# EasyEDA Pro project Baby8-seqV3.eprj

# Board PCB1
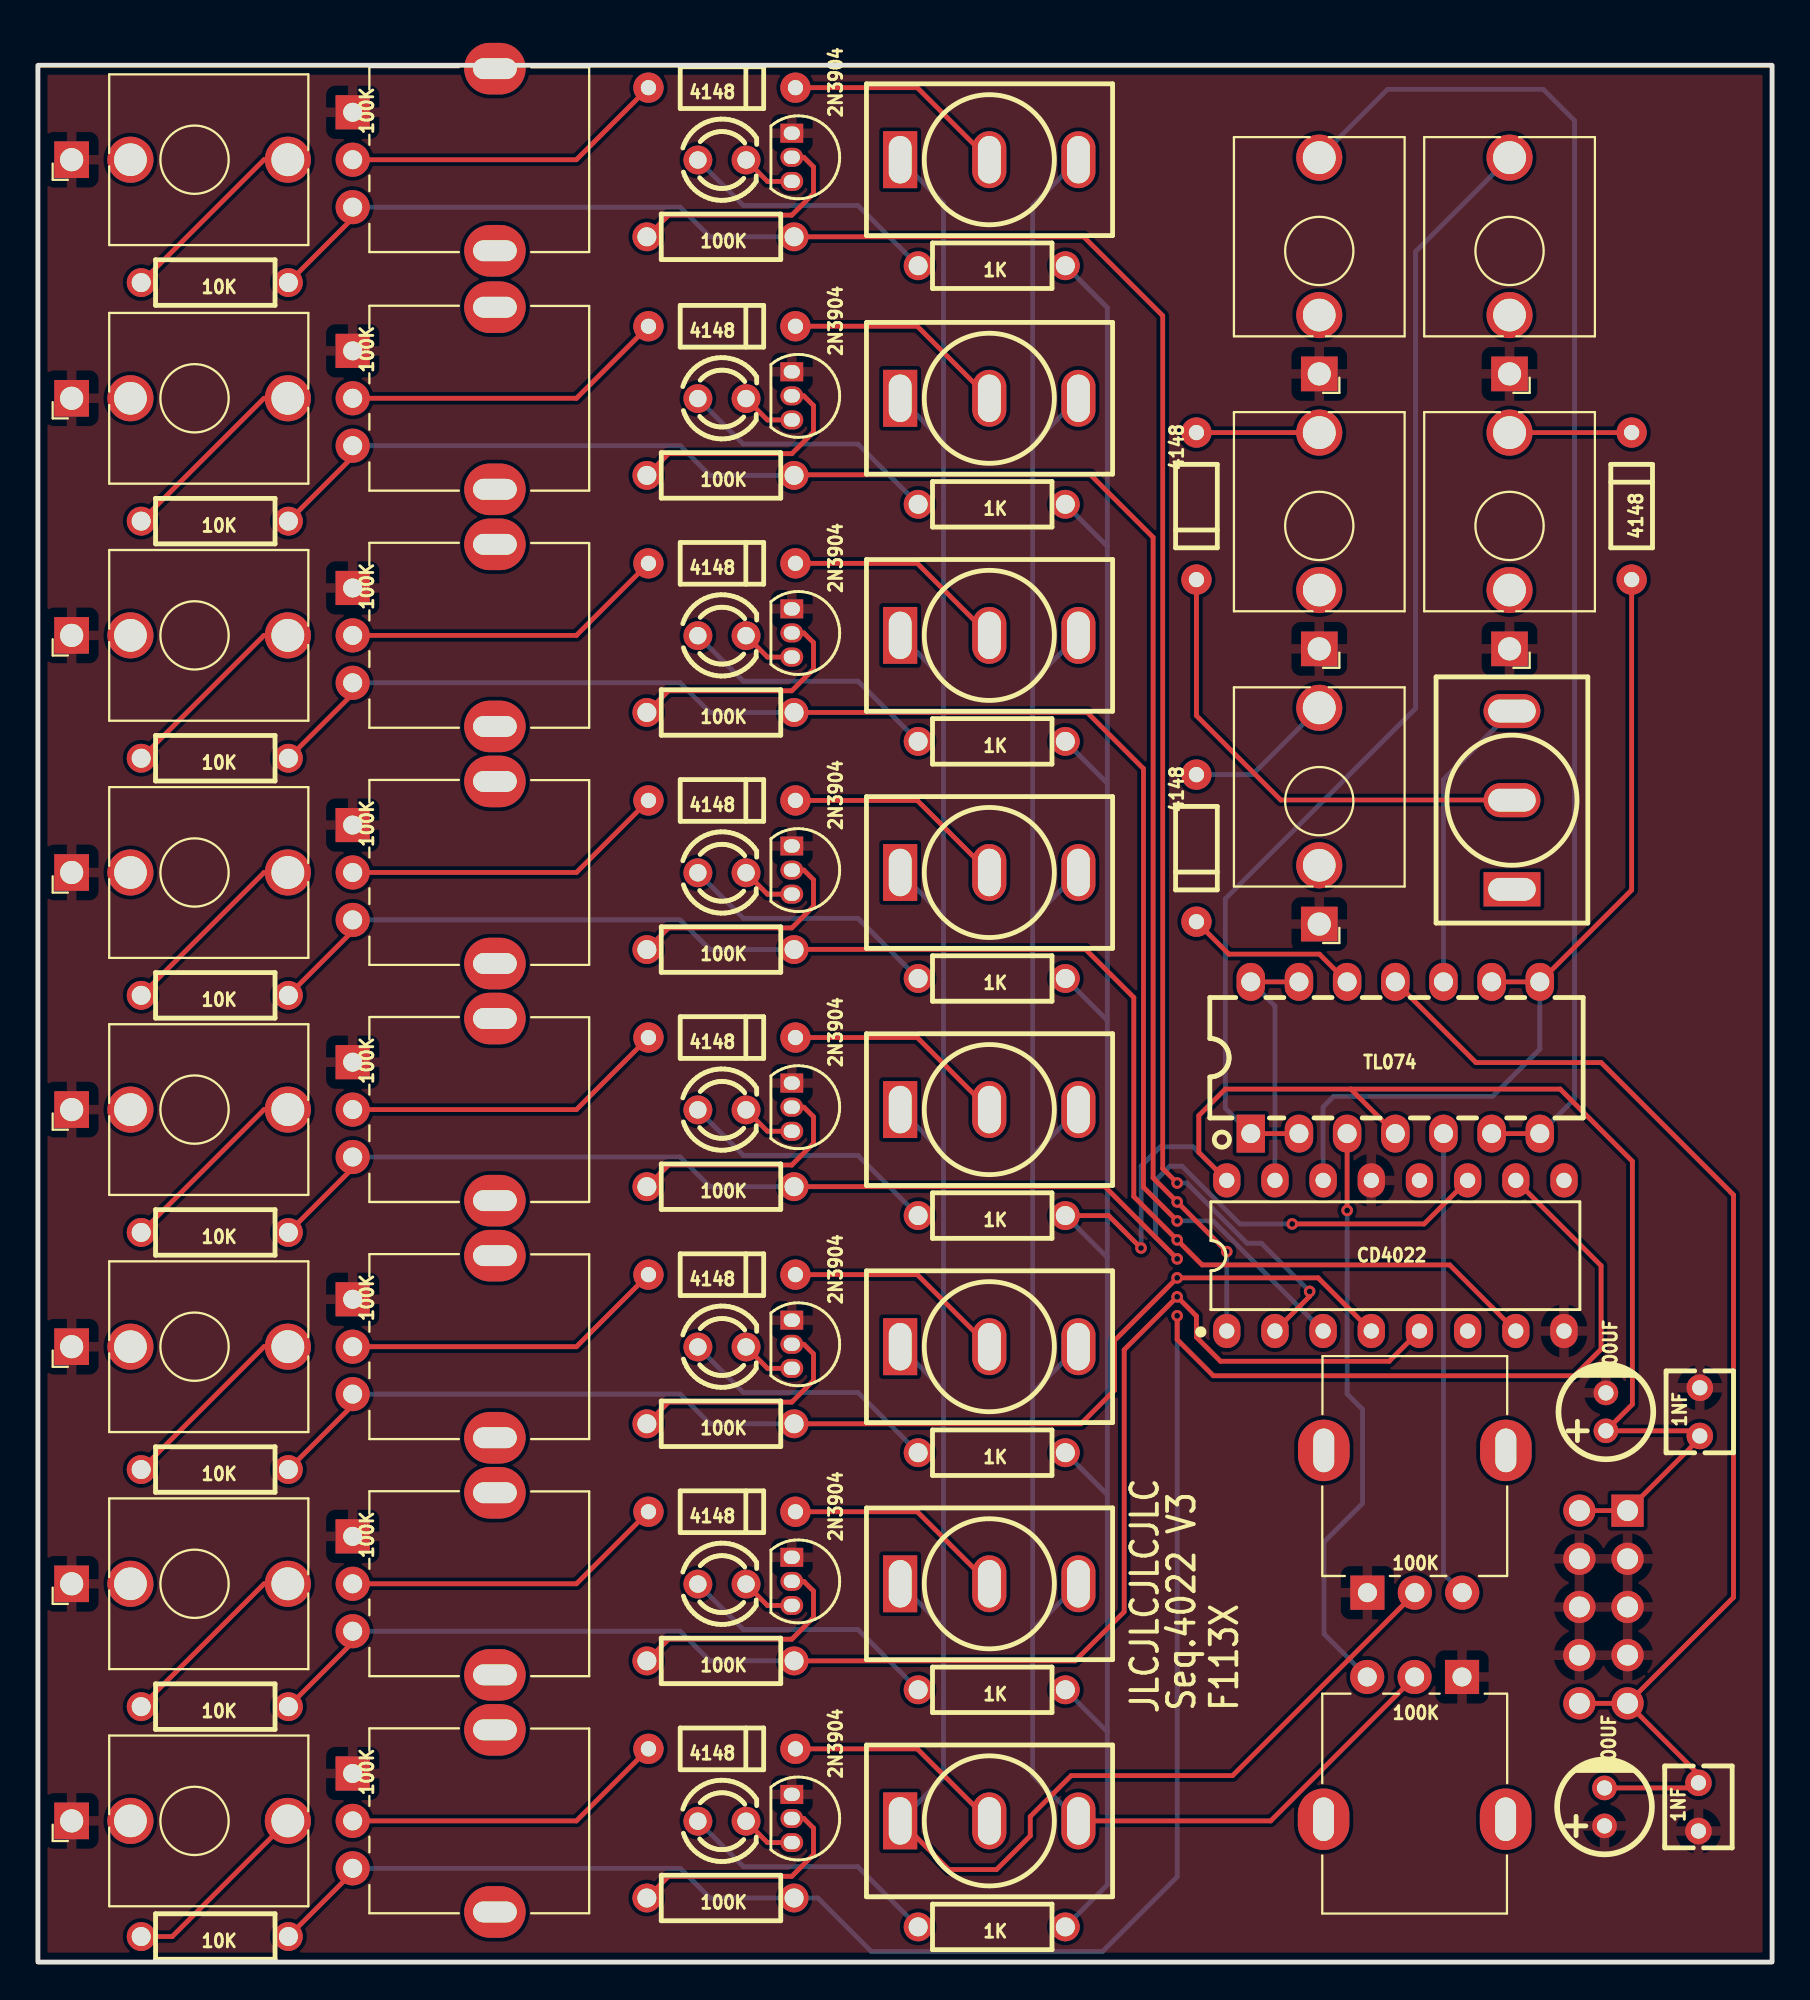
[diagram p0: board, top side]
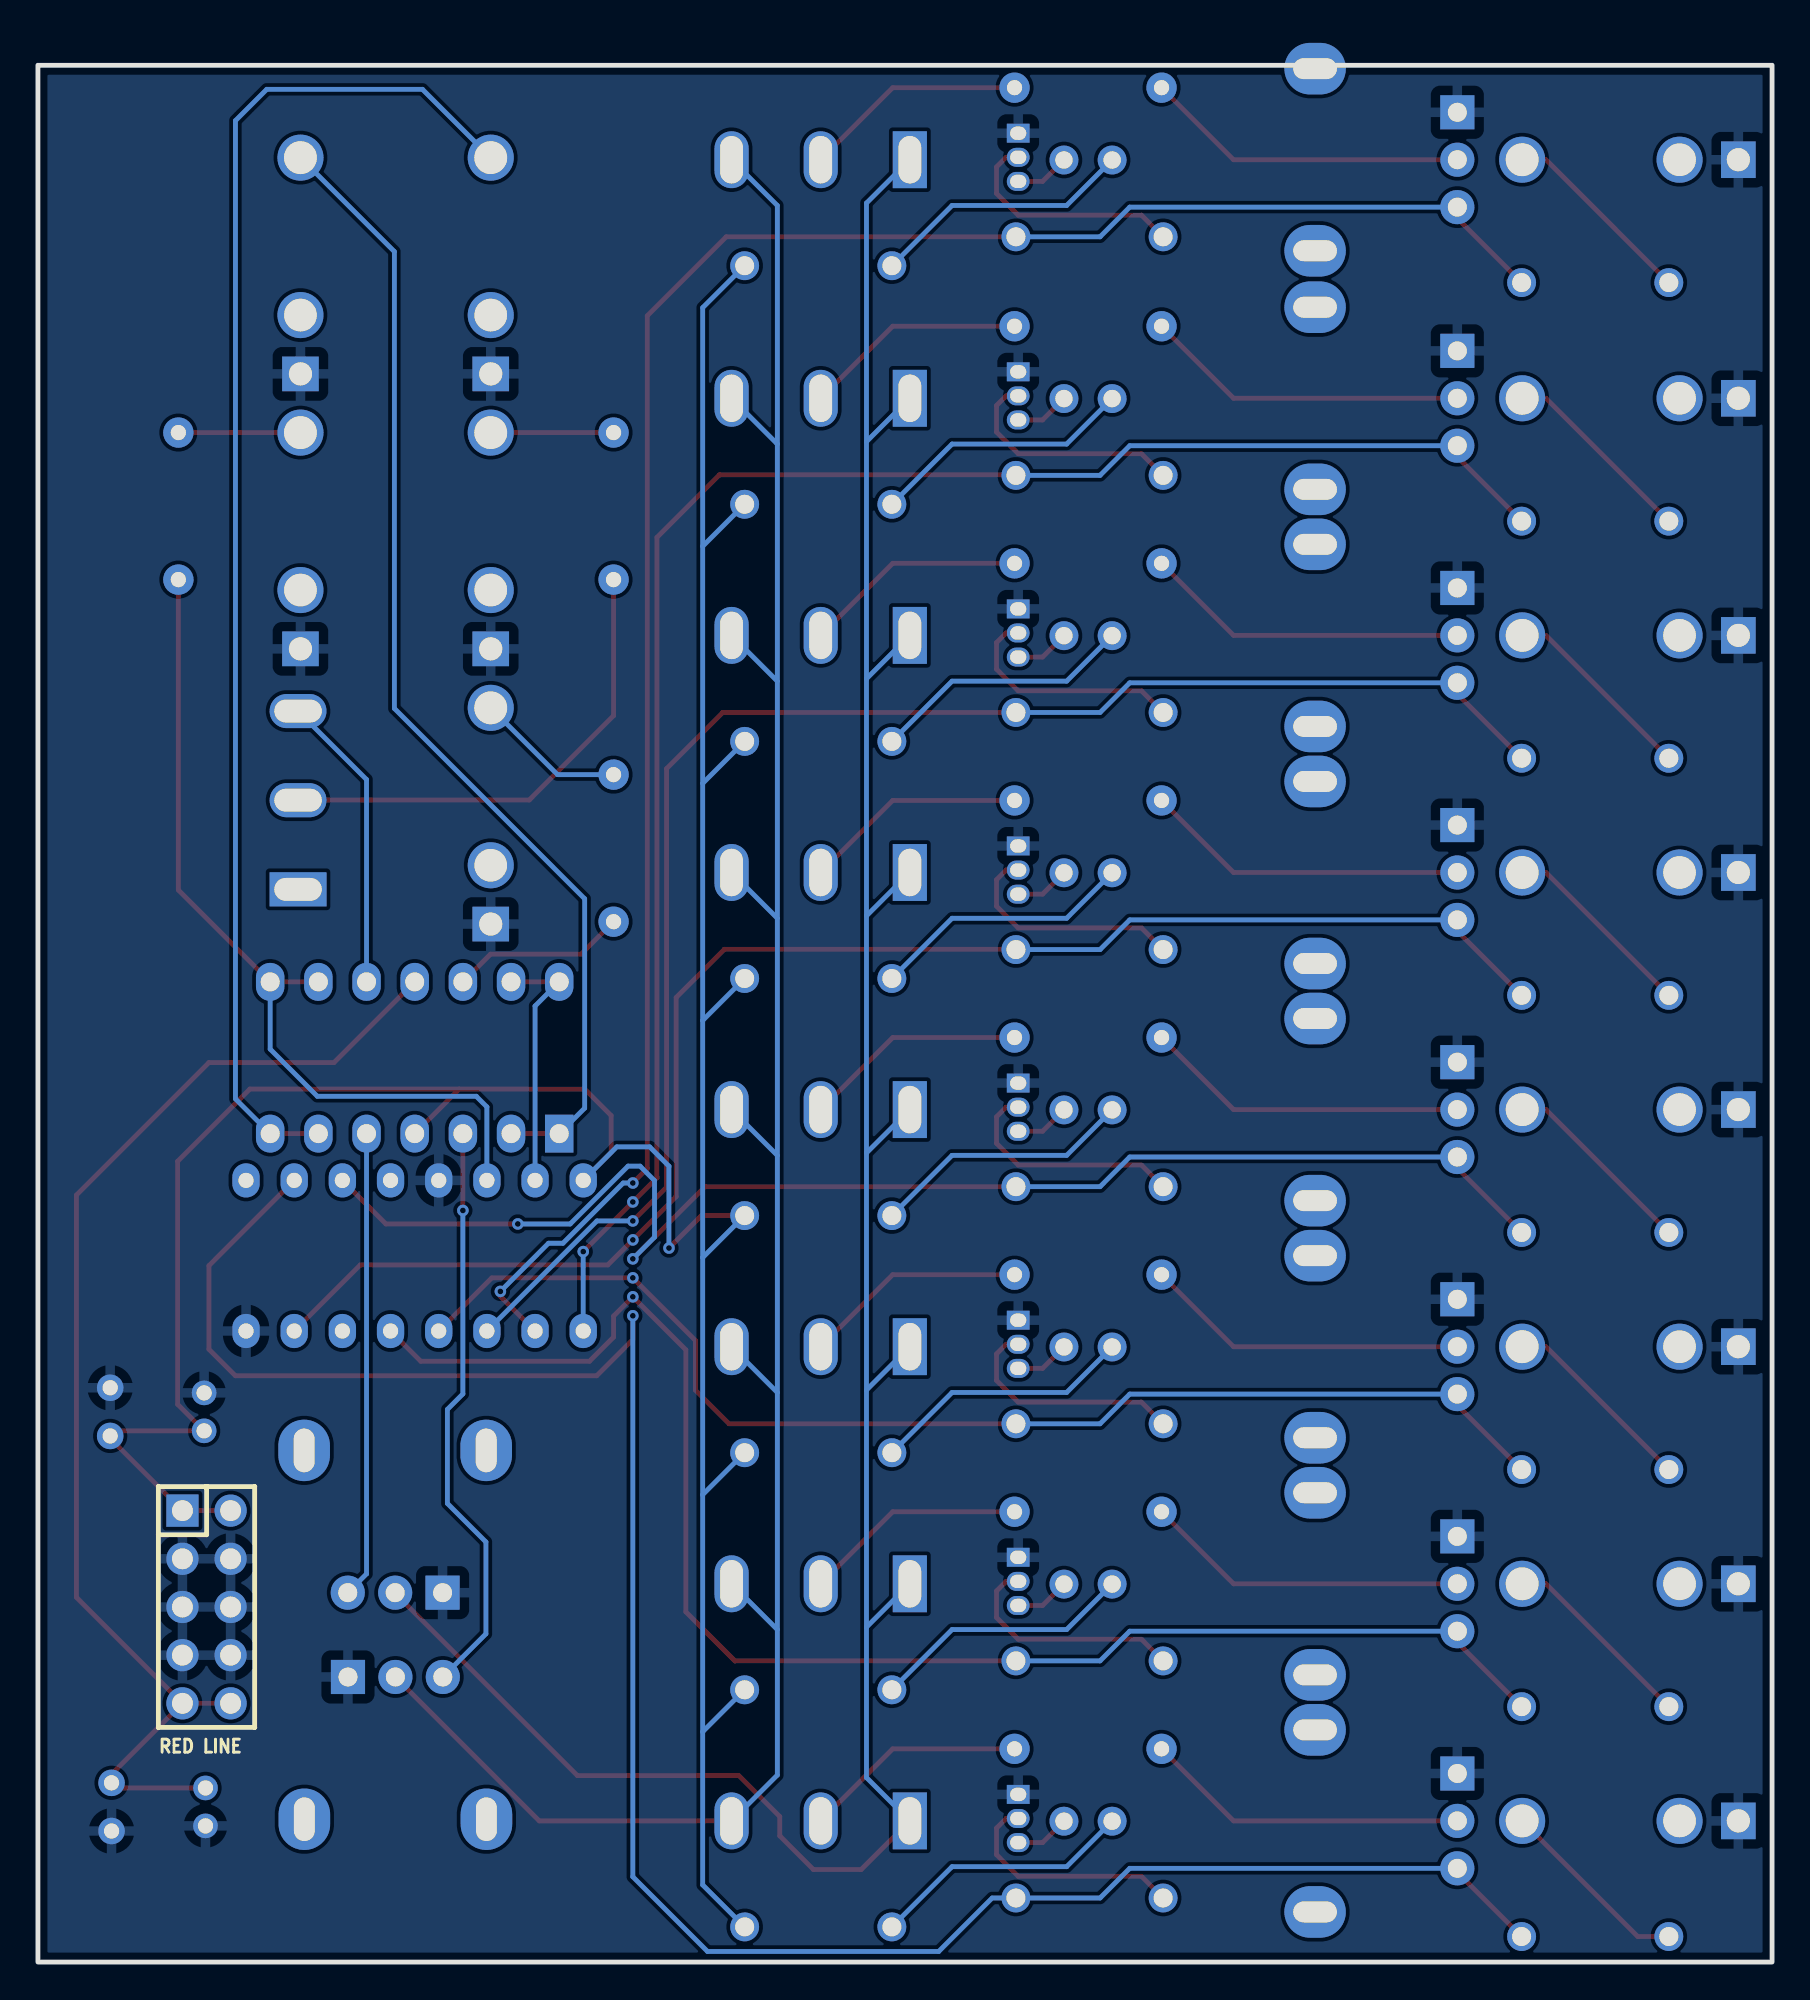
[diagram p1: board, bottom side, seen from below]

Outline 91.44 x 100 mm; copper layers: Top Layer, Bottom Layer. Coordinates in mm from the lower left corner of the outline.
Outline path: rectangle 0,100 91.44,0
Stack: Top Layer 0.035mm / Dielectric1 1.51mm FR4 er 4.5 / Bottom Layer 0.035mm

## Design rules (mm)
template: JLCPCB Capability(Two Layers Board)
spacing copperThickness1oz (default): track to track 0.102, other pairs 0.152 to 0.3
spacing copperThickness2oz: track to track 0.203, other pairs 0.152 to 0.3
track width copperThickness1oz (default): min 0.127, default 0.254, max 2.54
track width copperThickness2oz: min 0.203, default 0.254, max 2.54
differential pair differentialPair (default): width min 0.127, default 0.254, max 2.54; gap min 0.152, default 0.152
via viaSize (default): diameter min 0.5, default 0.61, max 10; hole min 0.3, default 0.305, max 6.3

## Placement (name value [footprint] x y rotation side)
1K  -  [Resistor_Small]  50.29 26.85 0 top
1K#2  -  [Resistor_Small]  50.29 89.43 0 top
1K#3  -  [Resistor_Small]  50.29 76.85 0 top
1K#4  -  [Resistor_Small]  50.29 64.35 0 top
1K#5  -  [Resistor_Small]  50.29 51.85 0 top
1K#6  -  [Resistor_Small]  50.29 39.35 0 top
1K#7  -  [Resistor_Small]  50.29 14.35 0 top
1K#8  -  [Resistor_Small]  50.29 1.85 0 top
1NF  -  [CAP-TH_L4.2-W3.5-P2.54-D0.5]  87.56 8.18 90 top
1NF#2  -  [CAP-TH_L4.2-W3.5-P2.54-D0.5]  87.63 29.01 90 top
2N3904  -  [TO-92-3_L4.5-W3.5-P1.27-L]  39.75 95.15 270 top
2N3904#2  -  [TO-92-3_L4.5-W3.5-P1.27-L]  39.75 82.57 270 top
2N3904#3  -  [TO-92-3_L4.5-W3.5-P1.27-L]  39.75 70.07 270 top
2N3904#4  -  [TO-92-3_L4.5-W3.5-P1.27-L]  39.75 57.57 270 top
2N3904#5  -  [TO-92-3_L4.5-W3.5-P1.27-L]  39.75 45.07 270 top
2N3904#6  -  [TO-92-3_L4.5-W3.5-P1.27-L]  39.75 32.57 270 top
2N3904#7  -  [TO-92-3_L4.5-W3.5-P1.27-L]  39.75 20.07 270 top
2N3904#8  -  [TO-92-3_L4.5-W3.5-P1.27-L]  39.75 7.57 270 top
10K  -  [Resistor_Small]  9.32 88.54 0 top
10K#2  -  [Resistor_Small]  9.32 75.97 0 top
10K#3  -  [Resistor_Small]  9.32 63.47 0 top
10K#4  -  [Resistor_Small]  9.32 50.97 0 top
10K#5  -  [Resistor_Small]  9.32 38.47 0 top
10K#6  -  [Resistor_Small]  9.32 25.97 0 top
10K#7  -  [Resistor_Small]  9.32 13.47 0 top
10K#8  -  [Resistor_Small]  9.32 1.35 0 top
100K  -  [Resistor_Small]  35.99 90.96 0 top
100K#2  -  [Resistor_Small]  35.99 78.38 0 top
100K#3  -  [Resistor_Small]  35.99 65.88 0 top
100K#4  -  [Resistor_Small]  35.99 53.38 0 top
100K#5  -  [Resistor_Small]  35.99 40.88 0 top
100K#6  -  [Resistor_Small]  35.99 28.38 0 top
100K#7  -  [Resistor_Small]  35.99 15.88 0 top
100K#8  -  [Resistor_Small]  35.99 3.38 0 top
100K#9  -  [benjiaomodular:Potentiometer_RV09]  16.6 97.52 0 top
100K#10  -  [benjiaomodular:Potentiometer_RV09]  16.6 84.94 0 top
100K#11  -  [benjiaomodular:Potentiometer_RV09]  16.6 72.44 0 top
100K#12  -  [benjiaomodular:Potentiometer_RV09]  16.6 59.94 0 top
100K#13  -  [benjiaomodular:Potentiometer_RV09]  16.6 47.44 0 top
100K#14  -  [benjiaomodular:Potentiometer_RV09]  16.6 34.94 0 top
100K#15  -  [benjiaomodular:Potentiometer_RV09]  16.6 22.44 0 top
100K#16  -  [benjiaomodular:Potentiometer_RV09]  16.6 9.94 0 top
100K#17  -  [benjiaomodular:Potentiometer_RV09]  70.1 19.47 90 top
100K#18  -  [benjiaomodular:Potentiometer_RV09]  75.09 15.03 270 top
100UF  -  [CAP-TH_BD5.0-P2.00-D0.8-FD]  82.6 8.18 90 top
100UF#2  -  [CAP-TH_BD5.0-P2.00-D0.8-FD]  82.68 29.01 90 top
4148  -  [DO-35_BD2.0-L4.2-P8.20-D0.5-RD]  61.09 76.76 90 top
4148#2  -  [DO-35_BD2.0-L4.2-P8.20-D0.5-RD]  84.04 76.76 270 top
4148#3  -  [DO-35_BD2.0-L4.2-P8.20-D0.5-RD]  36.07 98.82 180 top
4148#4  -  [DO-35_BD2.0-L4.2-P8.20-D0.5-RD]  61.09 58.72 90 top
4148#5  -  [DO-35_BD2.0-L4.2-P8.20-D0.5-RD]  36.07 86.24 180 top
4148#6  -  [DO-35_BD2.0-L4.2-P8.20-D0.5-RD]  36.07 73.74 180 top
4148#7  -  [DO-35_BD2.0-L4.2-P8.20-D0.5-RD]  36.07 61.24 180 top
4148#8  -  [DO-35_BD2.0-L4.2-P8.20-D0.5-RD]  36.07 48.74 180 top
4148#9  -  [DO-35_BD2.0-L4.2-P8.20-D0.5-RD]  36.07 36.24 180 top
4148#10  -  [DO-35_BD2.0-L4.2-P8.20-D0.5-RD]  36.07 23.74 180 top
4148#11  -  [DO-35_BD2.0-L4.2-P8.20-D0.5-RD]  36.07 11.24 180 top
CD4022  CD4017CN  [PDIP-16_L19.3-W6.4-P2.54-LS7.94-BL]  71.58 37.24 0 top
J1  -  [benjiaomodular:AudioJack_3.5mm]  1.78 95.02 90 top
J1#2  -  [benjiaomodular:AudioJack_3.5mm]  1.78 82.44 90 top
J1#3  -  [benjiaomodular:AudioJack_3.5mm]  1.78 69.94 90 top
J1#4  -  [benjiaomodular:AudioJack_3.5mm]  1.78 57.44 90 top
J1#5  -  [benjiaomodular:AudioJack_3.5mm]  1.78 44.94 90 top
J1#6  -  [benjiaomodular:AudioJack_3.5mm]  1.78 32.44 90 top
J1#7  -  [benjiaomodular:AudioJack_3.5mm]  1.78 19.94 90 top
J1#8  -  [benjiaomodular:AudioJack_3.5mm]  1.78 7.44 90 top
J1#9  -  [benjiaomodular:AudioJack_3.5mm]  67.56 69.23 180 top
J1#10  -  [benjiaomodular:AudioJack_3.5mm]  77.6 69.23 180 top
J1#11  -  [benjiaomodular:AudioJack_3.5mm]  77.6 83.73 180 top
J1#12  -  [benjiaomodular:AudioJack_3.5mm]  67.56 83.73 180 top
J1#13  -  [benjiaomodular:AudioJack_3.5mm]  67.56 54.72 180 top
LED1  -  [LED-TH_BD3.0-P2.54-FD]  36.07 95 0 top
LED1#2  -  [LED-TH_BD3.0-P2.54-FD]  36.07 82.43 0 top
LED1#3  -  [LED-TH_BD3.0-P2.54-FD]  36.07 69.93 0 top
LED1#4  -  [LED-TH_BD3.0-P2.54-FD]  36.07 57.43 0 top
LED1#5  -  [LED-TH_BD3.0-P2.54-FD]  36.07 44.93 0 top
LED1#6  -  [LED-TH_BD3.0-P2.54-FD]  36.07 32.43 0 top
LED1#7  -  [LED-TH_BD3.0-P2.54-FD]  36.07 19.93 0 top
LED1#8  -  [LED-TH_BD3.0-P2.54-FD]  36.07 7.43 0 top
RED LINE  ZX-PZ2.54-2-5PZZ  [HDR-TH_10P-P2.54-V-M-R2-C5-S2.54]  82.55 18.72 270 bottom
TL074  TL074CN  [PDIP-14_L19.7-W6.6-P2.54-LS8.3-BL]  71.57 47.68 0 top
U1  -  [SW-TH_MT-0-103-A101-M200-RS]  50.16 95.02 0 top
U1#2  -  [SW-TH_MT-0-103-A101-M200-RS]  77.72 61.25 90 top
U1#3  -  [SW-TH_MT-0-103-A101-M200-RS]  50.16 82.44 0 top
U1#4  -  [SW-TH_MT-0-103-A101-M200-RS]  50.16 69.94 0 top
U1#5  -  [SW-TH_MT-0-103-A101-M200-RS]  50.16 57.44 0 top
U1#6  -  [SW-TH_MT-0-103-A101-M200-RS]  50.16 44.94 0 top
U1#7  -  [SW-TH_MT-0-103-A101-M200-RS]  50.16 32.44 0 top
U1#8  -  [SW-TH_MT-0-103-A101-M200-RS]  50.16 19.94 0 top
U1#9  -  [SW-TH_MT-0-103-A101-M200-RS]  50.16 7.44 0 top

## Footprints (pads in the part's own frame, mm; a bottom-side part is the same pattern mirrored in y, then rotated)
benjiaomodular:AudioJack_3.5mm
  rect 1.93x1.83 hole 1.22: S(0,0)
  round 2.43 hole 1.73: T(0,-11.4)
  round 2.43 hole 1.72: TN(0,-3.1)
benjiaomodular:Potentiometer_RV09
  rect 1.8x1.8 hole 1: 1(0,0)
  round 1.8 hole 1: 2(0,-2.5) 3(0,-5)
  oval 3.24x2.72 hole 2.3x1.1: 4(7.5,-7.3) 5(7.5,2.3)
CAP-TH_BD5.0-P2.00-D0.8-FD
  round 1.3 hole 0.8: 1(-1,0) 2(1,0)
CAP-TH_L4.2-W3.5-P2.54-D0.5
  round 1.4 hole 0.8: 1(-1.27,0) 2(1.27,0)
DO-35_BD2.0-L4.2-P8.20-D0.5-RD
  round 1.6 hole 0.8: 1(-3.876,0) 2(3.876,0)
HDR-TH_10P-P2.54-V-M-R2-C5-S2.54
  rect 1.7x1.7 hole 1.1: 1(-5.08,-1.27)
  round 1.7 hole 1.1: 2(-5.08,1.27) 3(-2.54,-1.27) 4(-2.54,1.27) 5(0,-1.27) 6(0,1.27) 7(2.54,-1.27) 8(2.54,1.27) 9(5.08,-1.27) 10(5.08,1.27)
LED-TH_BD3.0-P2.54-FD
  round 1.524 hole 0.914: 1(-1.27,0) 2(1.27,0)
PDIP-14_L19.7-W6.6-P2.54-LS8.3-BL
  rect 1.5x2 hole 1: 1(-7.62,-4)
  oval 1.5x2 hole 1: 2(-5.08,-4) 3(-2.54,-4) 4(0,-4) 5(2.54,-4) 6(5.08,-4) 7(7.62,-4) 8(7.62,4) 9(5.08,4) 10(2.54,4) 11(0,4) 12(-2.54,4) 13(-5.08,4) 14(-7.62,4)
PDIP-16_L19.3-W6.4-P2.54-LS7.94-BL
  oval 1.44x1.8 hole 0.8: 1(-8.89,-3.97) 2(-6.35,-3.97) 3(-3.81,-3.97) 4(-1.27,-3.97) 5(1.27,-3.97) 6(3.81,-3.97) 7(6.35,-3.97) 8(8.89,-3.97) 9(8.89,3.97) 10(6.35,3.97) 11(3.81,3.97) 12(1.27,3.97) 13(-1.27,3.97) 14(-3.81,3.97) 15(-6.35,3.97) 16(-8.89,3.97)
Resistor_Small
  round 1.524 hole 1: 1(-3.88,0) 2(3.882,0)
SW-TH_MT-0-103-A101-M200-RS
  rect 1.8x3 hole 1.2x2.5: 1(-4.7,0)
  oval 1.8x3 hole 1.2x2.5: 2(0,0) 3(4.7,0)
TO-92-3_L4.5-W3.5-P1.27-L
  rect 1x1.2 hole 0.7x0.85: 1(-1.27,0)
  oval 1x1.2 hole 0.7x0.85: 2(0,0) 3(1.27,0)

## Nets
GND: 1NF.1 1NF#2.2 2N3904.1 2N3904#2.1 2N3904#3.1 2N3904#4.1 2N3904#5.1 2N3904#6.1 2N3904#7.1 2N3904#8.1 100K#9.1 100K#10.1 100K#11.1 100K#12.1 100K#13.1 100K#14.1 100K#15.1 100K#16.1 100K#17.1 100K#18.1 100UF.1 100UF#2.2 CD4022.8 CD4022.13 J1.S J1#2.S J1#3.S J1#4.S J1#5.S J1#6.S J1#7.S J1#8.S J1#9.S J1#10.S J1#11.S J1#12.S J1#13.S RED LINE.3 RED LINE.4 RED LINE.5 RED LINE.6 RED LINE.7 RED LINE.8
+12: 1K.2 1K#2.2 1K#3.2 1K#4.2 1K#5.2 1K#6.2 1K#7.2 1K#8.2 1NF#2.1 100UF#2.1 CD4022.16 RED LINE.1 RED LINE.2 TL074.4
-12: 1NF.2 100UF.2 RED LINE.9 RED LINE.10 TL074.11
CLK: 4148#2.2 CD4022.14 TL074.8 TL074.9
CLK_IN: 4148.2 J1#9.T
CLK_OUT: 4148#2.1 J1#10.T
CV1: J1#12.T TL074.6 TL074.7
CV2: J1#11.T TL074.1 TL074.2
RST: CD4022.15 TL074.13 TL074.14
RST_IN: 4148#4.2 J1#13.T
STEP1: 10K.2 100K.2 100K#9.3 CD4022.2
STEP2: 10K#2.2 100K#2.2 100K#10.3 CD4022.1
STEP3: 10K#3.2 100K#3.2 100K#11.3 CD4022.3
STEP4: 10K#4.2 100K#4.2 100K#12.3 CD4022.7
STEP5: 10K#5.2 100K#5.2 100K#13.3 CD4022.11
STEP6: 10K#6.2 100K#6.2 100K#14.3 CD4022.4
STEP7: 10K#7.2 100K#7.2 100K#15.3 CD4022.5
STEP8: 10K#8.2 100K#8.2 100K#16.3 CD4022.10
TRACK1: 100K#17.2 U1.1 U1#3.1 U1#4.1 U1#5.1 U1#6.1 U1#7.1 U1#8.1 U1#9.1
TRACK1+: 100K#17.3 TL074.5
TRACK2: 100K#18.2 U1.3 U1#3.3 U1#4.3 U1#5.3 U1#6.3 U1#7.3 U1#8.3 U1#9.3
TRACK2+: 100K#18.3 TL074.3

Pads without a net: 1K 1; 1K#2 1; 1K#3 1; 1K#4 1; 1K#5 1; 1K#6 1; 1K#7 1; 1K#8 1; 2N3904 2 3; 2N3904#2 2 3; 2N3904#3 2 3; 2N3904#4 2 3; 2N3904#5 2 3; 2N3904#6 2 3; 2N3904#7 2 3; 2N3904#8 2 3; 10K 1; 10K#2 1; 10K#3 1; 10K#4 1; 10K#5 1; 10K#6 1; 10K#7 1; 10K#8 1; 100K 1; 100K#2 1; 100K#3 1; 100K#4 1; 100K#5 1; 100K#6 1; 100K#7 1; 100K#8 1; 100K#9 2 4 5; 100K#10 2 4 5; 100K#11 2 4 5; 100K#12 2 4 5; 100K#13 2 4 5; 100K#14 2 4 5; 100K#15 2 4 5; 100K#16 2 4 5; 100K#17 4 5; 100K#18 4 5; 4148 1; 4148#3 1 2; 4148#4 1; 4148#5 1 2; 4148#6 1 2; 4148#7 1 2; 4148#8 1 2; 4148#9 1 2; 4148#10 1 2; 4148#11 1 2; CD4022 6 9 12; J1 T TN; J1#2 T TN; J1#3 T TN; J1#4 T TN; J1#5 T TN; J1#6 T TN; J1#7 T TN; J1#8 T TN; J1#9 TN; J1#10 TN; J1#11 TN; J1#12 TN; J1#13 TN; LED1 1 2; LED1#2 1 2; LED1#3 1 2; LED1#4 1 2; LED1#5 1 2; LED1#6 1 2; LED1#7 1 2; LED1#8 1 2; TL074 10 12; U1 2; U1#2 1 2 3; U1#3 2; U1#4 2; U1#5 2; U1#6 2; U1#7 2; U1#8 2; U1#9 2

## Via types
v1: diameter 0.61, hole 0.305, Top Layer to Bottom Layer, 13 vias

## Routing (per net, layer and track width the routed paths; a pad name or vN(x,y) marks a point on that pad's centre or on a via; arc(x,y) is an arc through that point)
(no net): length 599.8
  Top Layer w0.254: 4148#8.2 28.39,44.94 100K#13.2 ; 10K#8.1 7.08,1.35 J1#8.T ; J1.T 11.92,95.02 10K.1 ; 4148#11.2 28.39,7.44 100K#16.2 ; 4148#4.1 62.8,53.14 67.57,53.14 69.03,51.68 ; 2N3904#4.3 38.47,56.3 LED1#4.2 ; 39.75,93.88 38.47,93.88 LED1.2 ; 100K#4.1 33.25,54.52 39.75,54.52 40.89,55.66 40.89,57.06 40.39,57.57 2N3904#4.2 ; 4148#9.2 28.39,32.44 100K#14.2 ; 4148#10.2 28.39,19.94 100K#15.2 ; 4148#6.2 28.39,69.94 100K#11.2 ; 4148#9.1 46.37,36.24 U1#7.2 ; U1#9.2 46.37,11.24 4148#11.1 ; U1#3.2 46.37,86.24 4148#5.1 ; 4148#10.1 46.37,23.74 U1#8.2 ; 10K#5.1 11.92,44.94 J1#5.T ; U1#5.2 46.37,61.24 4148#7.1 ; J1#2.T 11.92,82.44 10K#2.1 ; 2N3904#6.2 40.39,32.57 40.89,32.06 40.89,30.66 39.75,29.52 33.25,29.52 100K#6.1 ; 100K.1 33.25,92.1 39.75,92.1 40.89,93.24 40.89,94.64 40.39,95.15 2N3904.2 ; 10K#3.1 11.92,69.94 J1#3.T ; U1#2.2 77.71,61.27 65.53,61.27 61.09,65.71 4148.1 ; LED1#2.2 38.47,81.3 2N3904#2.3 ; 2N3904#5.2 40.39,45.07 40.89,44.56 40.89,43.16 39.75,42.02 33.25,42.02 100K#5.1 ; J1#6.T 11.92,32.44 10K#6.1 ; 4148#3.2 28.39,95.02 100K#9.2 ; 2N3904#8.2 40.39,7.57 40.89,7.06 40.89,5.66 39.75,4.52 33.25,4.52 100K#8.1 ; 2N3904#7.2 40.39,20.07 40.89,19.56 40.89,18.16 39.75,17.02 33.25,17.02 100K#7.1 ; 100K#12.2 28.39,57.44 4148#7.2 ; LED1#7.2 38.47,18.8 2N3904#7.3 ; 2N3904#2.2 40.39,82.57 40.89,82.06 40.89,80.66 39.75,79.52 33.25,79.52 100K#2.1 ; 2N3904#8.3 38.47,6.3 LED1#8.2 ; 4148#5.2 28.39,82.44 100K#10.2 ; U1#6.2 46.37,48.74 4148#8.1 ; 2N3904#5.3 38.47,43.8 LED1#5.2 ; LED1#3.2 38.47,68.8 2N3904#3.3 ; 4148#6.1 46.37,73.74 U1#4.2 ; U1.2 46.37,98.82 4148#3.1 ; 10K#4.1 11.92,57.44 J1#4.T ; 10K#7.1 11.92,19.94 J1#7.T ; 100K#3.1 33.25,67.02 39.75,67.02 40.89,68.16 40.89,69.56 40.39,70.07 2N3904#3.2 ; 2N3904#6.3 38.47,31.3 LED1#6.2
  Bottom Layer w0.254: LED1#2.1 37.2,80.03 43.24,80.03 1K#3.1 ; 1K#6.1 43.24,42.53 37.2,42.53 LED1#5.1 ; 1K.1 43.24,30.03 37.2,30.03 LED1#6.1 ; 1K#4.1 43.24,67.53 37.2,67.53 LED1#3.1 ; LED1#4.1 37.2,55.03 43.24,55.03 1K#5.1 ; 1K#7.1 43.24,17.53 37.2,17.53 LED1#7.1 ; 1K#2.1 43.24,92.61 37.2,92.61 LED1.1 ; TL074.10 74.11,62.34 U1#2.3 ; 1K#8.1 43.24,5.03 37.2,5.03 LED1#8.1
+12: length 183.2
  Top Layer w0.254: CD4022.16 61.21,42.68 61.21,44.63 62.61,46.03 69.22,46.03 ; v1(58.17,37.64) 56.45,39.35 1K#6.2 ; RED LINE.2 RED LINE.1 87.63,27.61 1NF#2.1 87.36,28.01 100UF#2.1 84.07,29.4 84.07,42.22 80.26,46.03 69.22,46.03 ; 69.22,46.03 TL074.4
  Bottom Layer w0.254: v1(58.17,37.64) 58.17,41.96 59.18,42.98 60.92,42.98 CD4022.16 ; 56.39,62.14 56.39,49.64 ; 56.39,62.14 1K#4.2 ; 56.39,62.14 56.39,74.64 ; 56.39,49.64 56.39,37.14 ; 56.39,49.64 1K#5.2 ; 56.39,12.14 56.39,4.07 1K#8.2 ; 56.39,12.14 1K#7.2 ; 56.39,12.14 56.39,24.64 ; 56.39,37.14 1K#6.2 ; 56.39,37.14 56.39,24.64 ; 1K#2.2 56.39,87.22 56.39,74.64 ; 1K.2 56.39,24.64 ; 56.39,74.64 1K#3.2
-12: length 64.9
  Top Layer w0.254: 100UF.2 87.29,9.18 1NF.2 87.56,9.9 RED LINE.9 ; RED LINE.9 89.41,19.23 89.41,40.44 82.42,47.42 75.83,47.42 TL074.11 ; RED LINE.9 RED LINE.10
CLK: length 45.9
  Top Layer w0.254: 76.65,51.68 TL074.8 84.04,56.52 4148#2.2
  Bottom Layer w0.254: TL074.8 79.19,48.13 76.71,45.64 68.33,45.64 67.77,45.08 CD4022.14
CLK_IN: length 6.5
  Top Layer w0.254: 4148.2 67.56,80.64 67.56,80.63
CLK_OUT: length 6.4
  Top Layer w0.254: 77.6,80.63 84.03,80.63 4148#2.1
CV1: length 72.3
  Top Layer w0.254: 76.65,43.68 TL074.7
  Bottom Layer w0.254: TL074.7 81.03,45.51 81.03,97.08 79.38,98.73 71.16,98.73 J1#12.T
CV2: length 60.8
  Top Layer w0.254: TL074.1 TL074.2
  Bottom Layer w0.254: J1#11.T 72.64,90.18 72.64,66.09 62.61,56.06 62.61,45.02 TL074.1
RST: length 13.5
  Top Layer w0.254: TL074.14 TL074.13
  Bottom Layer w0.254: TL074.14 65.23,50.4 CD4022.15
RST_IN: length 7.9
  Bottom Layer w0.254: J1#13.T 64.04,62.6 4148#4.2
STEP1: length 108.7
  Top Layer w0.254: 39.87,90.96 55.15,90.96 59.31,86.79 59.31,41.83 v1(60.07,41.07) ; 10K.2 16.6,91.93 100K#9.3 ; v1(67.06,35.36) 67.06,35.1 CD4022.2
  Bottom Layer w0.254: 39.87,90.96 35.43,90.96 33.87,92.52 100K#9.3 ; v1(67.06,35.36) 64.52,37.9 63.75,37.9 60.58,41.07 v1(60.07,41.07)
STEP2: length 93.1
  Top Layer w0.254: 10K#2.2 16.6,79.36 100K#10.3 ; 39.87,78.38 39.9,78.41 55.5,78.41 58.8,75.11 58.8,41.34 v1(60.07,40.07) v1(62.69,37.46)
  Bottom Layer w0.254: 100K#10.3 33.87,79.94 35.43,78.38 39.87,78.38 ; CD4022.1 v1(62.69,37.46)
STEP3: length 83.6
  Top Layer w0.254: 100K#11.3 16.6,66.86 10K#3.2 ; v1(60.07,39.07) 58.29,40.85 58.29,62.92 55.33,65.88 39.87,65.88
  Bottom Layer w0.254: v1(60.07,39.07) 61.96,39.07 CD4022.3 ; 39.87,65.88 35.43,65.88 33.87,67.44 100K#11.3
STEP4: length 81.8
  Top Layer w0.254: 100K#12.3 16.6,54.36 10K#4.2 ; CD4022.7 74.44,36.75 61.39,36.75 v1(60.07,38.07) 57.78,40.36 57.78,50.85 55.25,53.39 39.88,53.39 39.87,53.38
  Bottom Layer w0.254: 100K#12.3 33.87,54.94 35.43,53.38 39.87,53.38
STEP5: length 74.7
  Top Layer w0.254: v1(66.14,38.91) 73.09,38.91 CD4022.11 ; 39.87,40.88 56.26,40.88 v1(60.07,37.07) ; 10K#5.2 16.6,41.86 100K#13.3
  Bottom Layer w0.254: 100K#13.3 33.87,42.44 35.43,40.88 39.87,40.88 ; v1(66.14,38.91) 63.37,38.91 60.32,41.96 59.69,41.96 58.93,41.2 58.93,38.22 v1(60.07,37.07)
STEP6: length 65.6
  Top Layer w0.254: 39.87,28.38 55,28.38 56.77,30.15 56.77,32.77 v1(60.07,36.07) 67.5,36.07 CD4022.4 ; 100K#14.3 16.6,29.36 10K#6.2
  Bottom Layer w0.254: 39.87,28.38 35.43,28.38 33.87,29.94 100K#14.3
STEP7: length 81
  Top Layer w0.254: 10K#7.2 16.6,16.86 100K#15.3 ; CD4022.5 71.25,31.67 62.36,31.67 61.09,32.94 61.09,34.06 v1(60.07,35.07) 57.28,32.28 57.28,18.47 54.69,15.88 39.87,15.88
  Bottom Layer w0.254: 39.87,15.88 35.43,15.88 33.87,17.44 100K#15.3
STEP8: length 117.2
  Top Layer w0.254: 100K#16.3 16.6,4.74 10K#8.2 ; v1(60.07,34.07) 60.07,32.82 61.98,30.91 81.03,30.91 82.42,32.31 82.42,36.71 CD4022.10
  Bottom Layer w0.254: v1(60.07,34.07) 60.07,4.5 56.13,0.56 43.94,0.56 41.12,3.38 35.43,3.38 33.87,4.94 100K#16.3
TRACK1: length 143.7
  Top Layer w0.254: 100K#17.2 72.6,19.44 62.99,9.83 54.48,9.83 52.32,7.67 52.32,6.66 50.55,4.88 48.03,4.88 U1#9.1
  Bottom Layer w0.254: U1#4.1 47.75,67.66 ; 47.75,67.66 47.75,55.16 ; 47.75,67.66 47.75,80.16 ; 47.75,17.66 47.75,9.73 U1#9.1 ; 47.75,17.66 47.75,30.16 ; 47.75,17.66 U1#8.1 ; 47.75,30.16 U1#7.1 ; 47.75,30.16 47.75,42.66 ; 47.75,55.16 47.75,42.66 ; 47.75,55.16 U1#5.1 ; 47.75,42.66 U1#6.1 ; U1.1 47.75,92.73 47.75,80.16 ; U1#3.1 47.75,80.16
TRACK1+: length 24.6
  Bottom Layer w0.254: TL074.5 74.11,20.46 100K#17.3
TRACK2: length 130.9
  Top Layer w0.254: U1#9.3 65,7.44 100K#18.2
  Bottom Layer w0.254: U1#4.3 52.45,67.53 ; 52.45,67.53 52.45,55.03 ; 52.45,67.53 52.45,80.03 ; U1#3.3 52.45,80.03 ; 52.45,80.03 52.45,92.61 U1.3 ; 52.45,30.03 52.45,17.53 ; 52.45,30.03 U1#7.3 ; 52.45,30.03 52.45,42.53 ; 52.45,17.53 52.45,9.86 U1#9.3 ; 52.45,17.53 U1#8.3 ; 52.45,55.03 52.45,42.53 ; 52.45,55.03 U1#5.3 ; 52.45,42.53 U1#6.3
TRACK2+: length 30.8
  Top Layer w0.254: v1(69.03,39.62) 69.03,43.68
  Bottom Layer w0.254: v1(69.03,39.62) 69.03,29.95 69.85,29.13 69.85,24.18 67.82,22.15 67.82,17.3 100K#18.3

## Copper pours and planes (outline as drawn; the poured copper is in the pictures)
GND on Top Layer: 0,100 91.44,100 91.44,0 0,0
GND on Bottom Layer: 0,100 91.44,100 91.44,0 0,0

## Text on the board
Top Silkscreen Layer: JLCJLCJLCJLC | Seq.4022 V3 / F113X

# Board PCB2
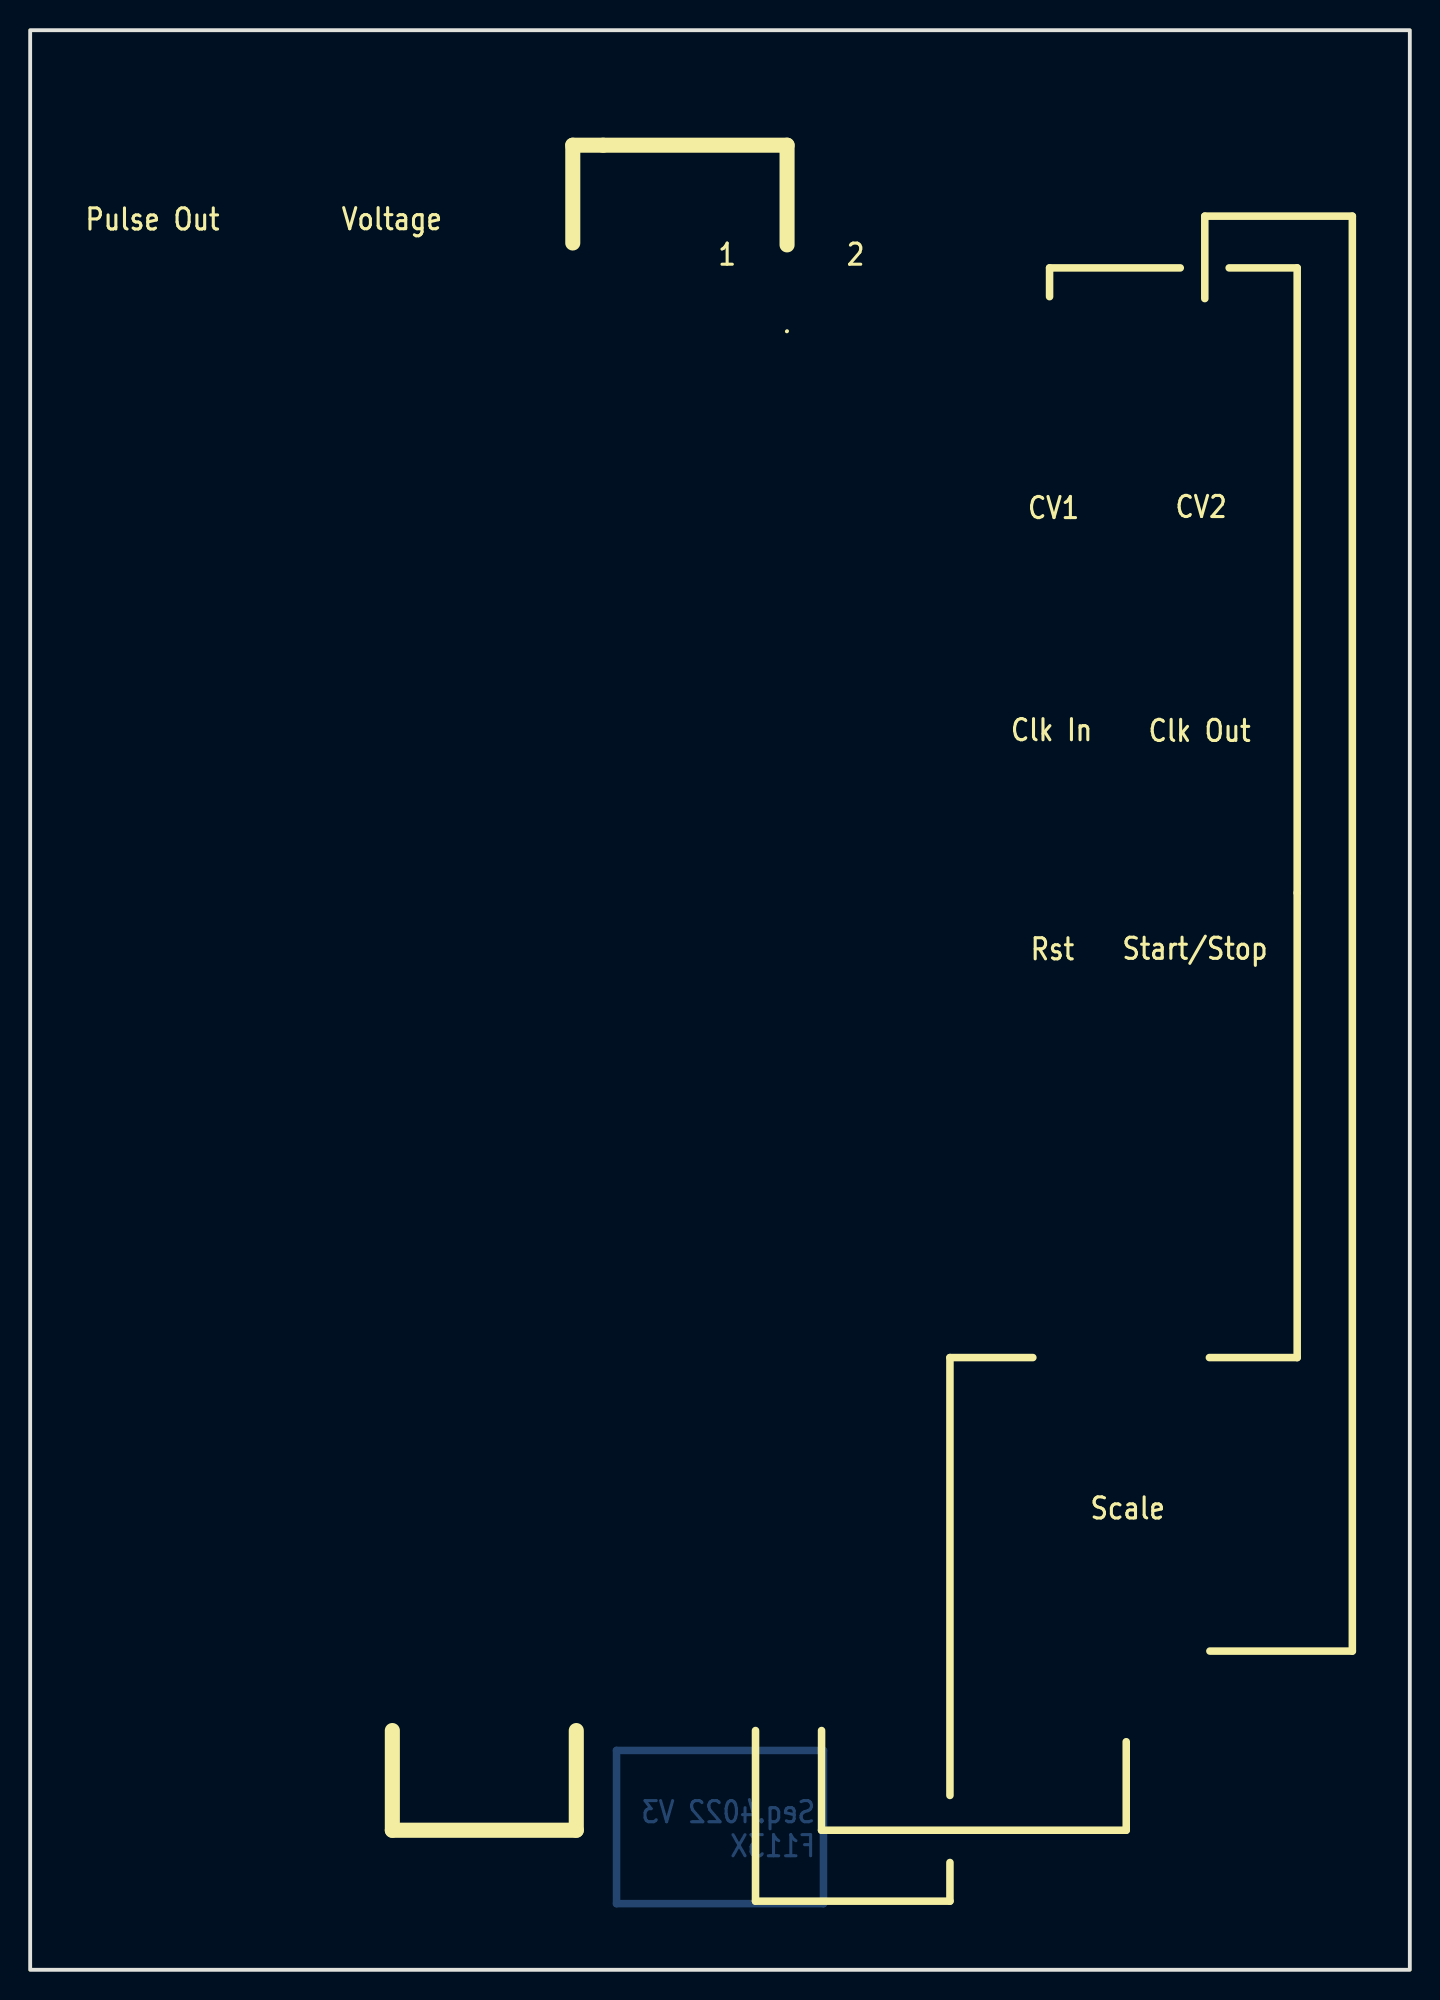
[diagram p2: board, top side]
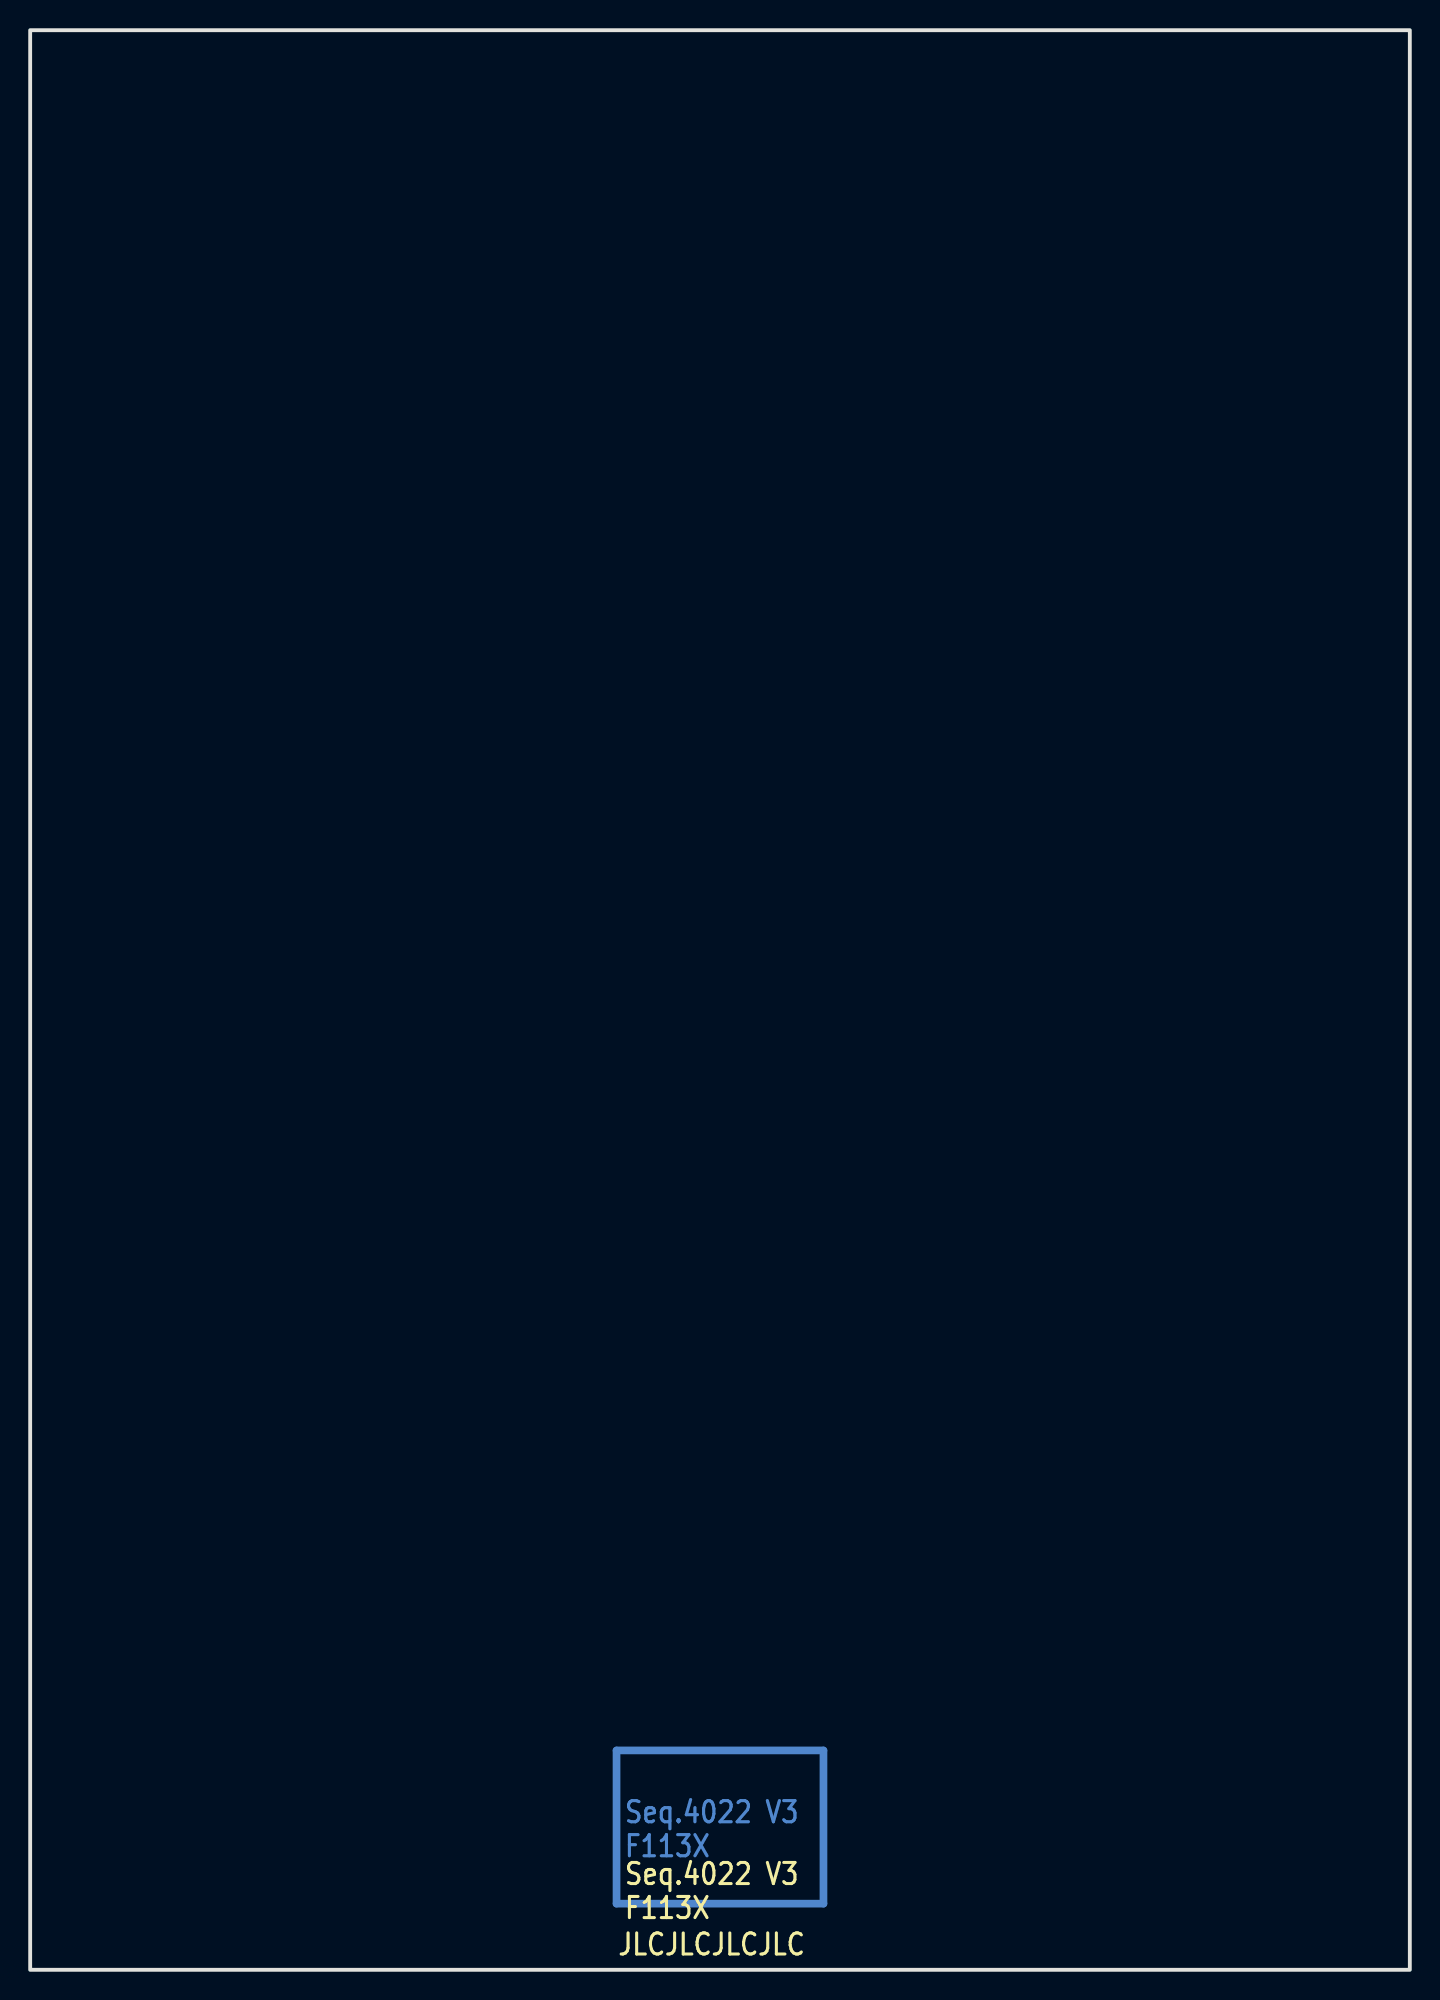
[diagram p3: board, bottom side, seen from below]

Outline 91.44 x 128.5 mm; copper layers: Top Layer, Bottom Layer. Coordinates in mm from the lower left corner of the outline.
Outline path: rectangle 0,128.5 91.44,0
Stack: Top Layer 0.035mm / Dielectric1 1.51mm FR4 er 4.5 / Bottom Layer 0.035mm

## Design rules (mm)
template: JLCPCB Capability(Two Layers Board)
spacing copperThickness1oz (default): track to track 0.102, other pairs 0.152 to 0.3
spacing copperThickness2oz: track to track 0.203, other pairs 0.152 to 0.3
track width copperThickness1oz (default): min 0.127, default 0.254, max 2.54
track width copperThickness2oz: min 0.203, default 0.254, max 2.54
differential pair differentialPair (default): width min 0.127, default 0.254, max 2.54; gap min 0.152, default 0.152
via viaSize (default): diameter min 0.5, default 0.61, max 10; hole min 0.3, default 0.305, max 6.3

## Placement (name value [footprint] x y rotation side)

## Nets

## Copper pours and planes (outline as drawn; the poured copper is in the pictures)
GND on Bottom Layer: 0,128.5 91.44,128.5 91.44,0 0,0

## Text on the board
Bottom Layer: Seq.4022 V3 / F113X
Bottom Silkscreen Layer: Seq.4022 V3 / F113X | JLCJLCJLCJLC
Top Silkscreen Layer: Pulse Out | Voltage | 1 | 2 | Clk In | CV1 | Rst | Scale | Start/Stop | Clk Out | CV2
